# EAGLE schematic estop v2 (EAGLE 9.2.1)
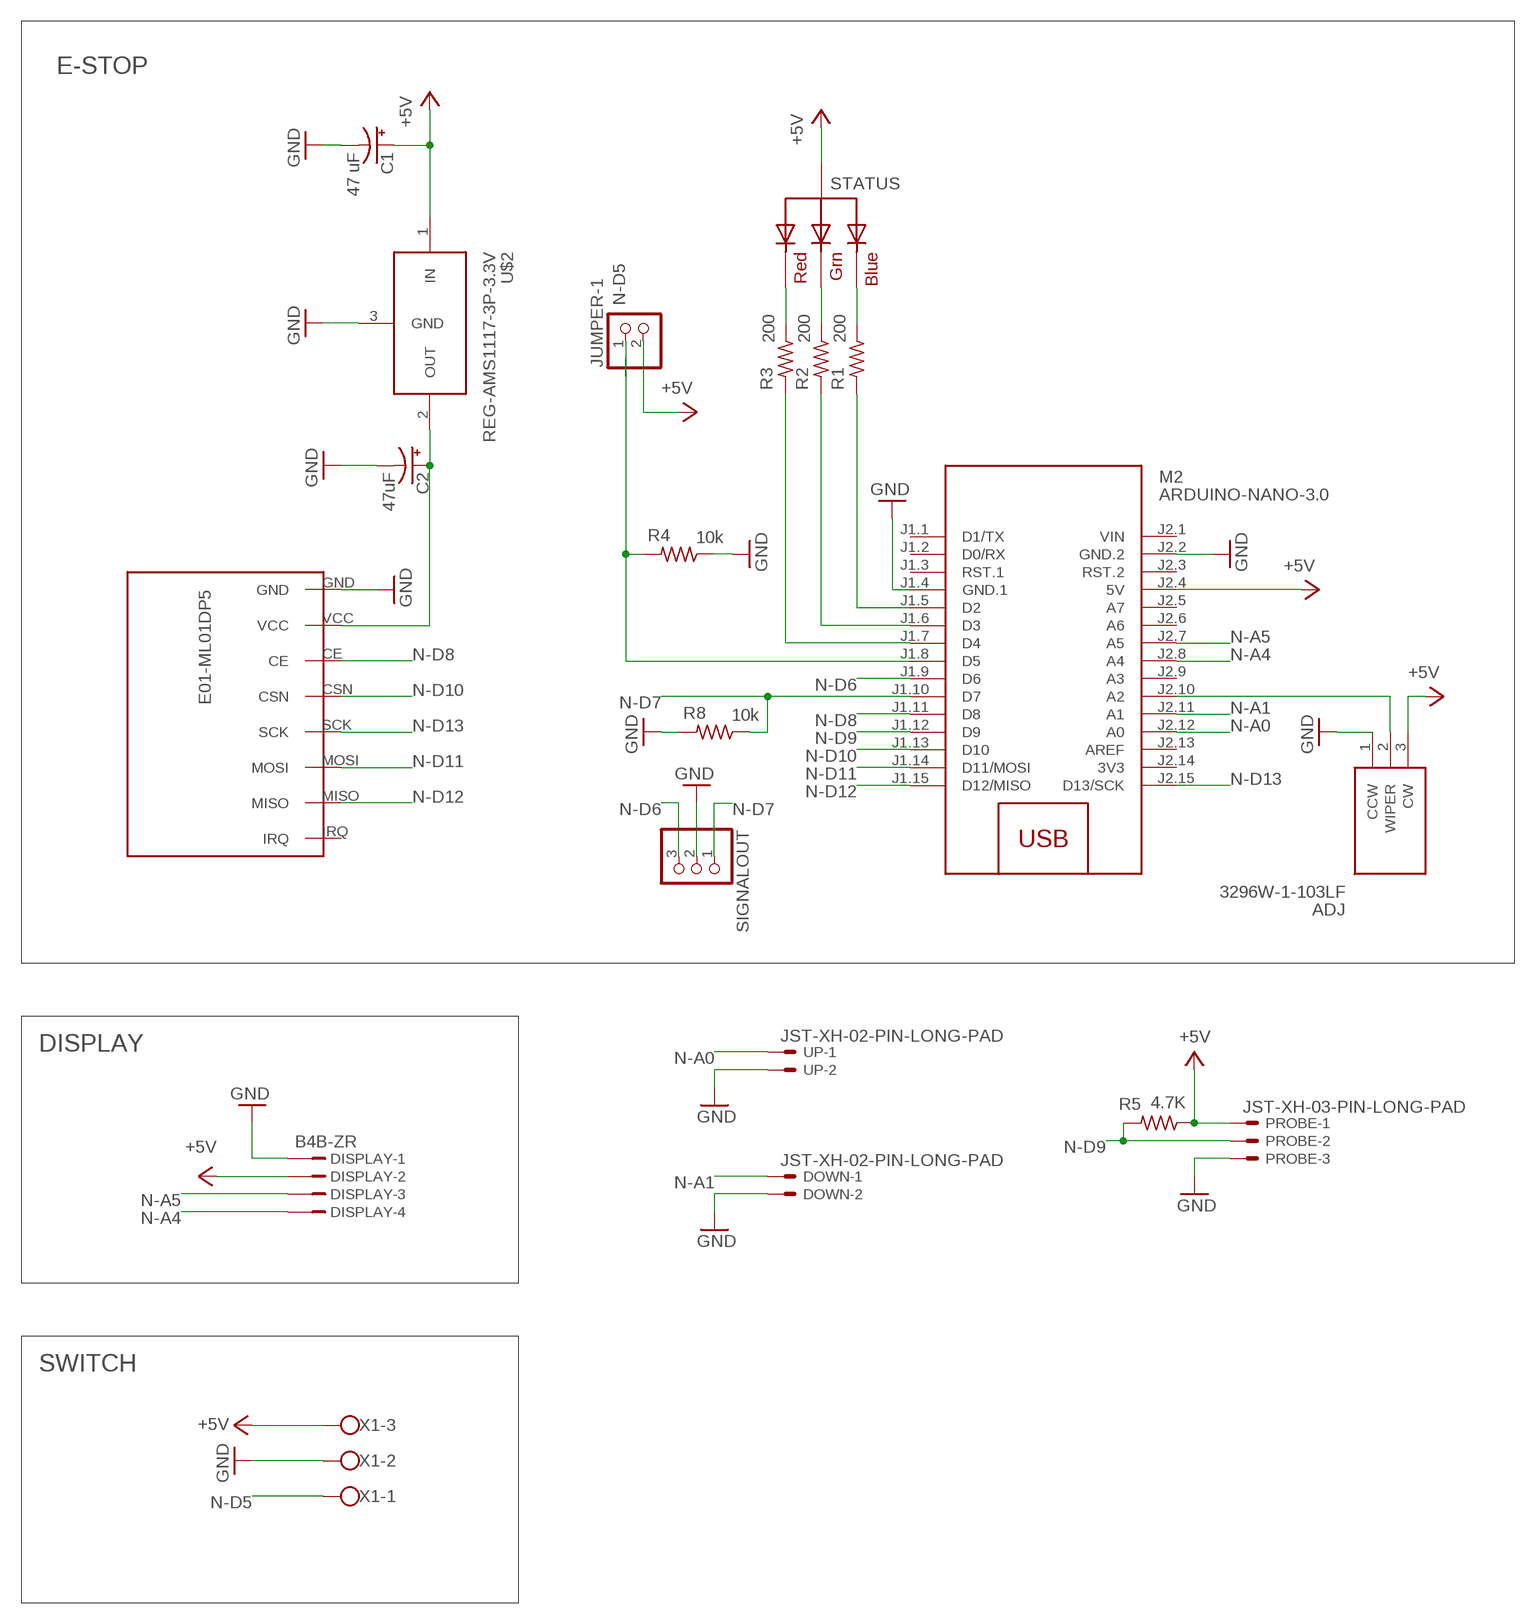
[diagram p0: schematic, sheet 1]

## Parts
ADJ  3296W-1-103LF  [SHDR3W54P0X254_1X3_953X483X115]
C1  47 uF  CPOL-USE2.5-5  [E2,5-5]
C2  47uF  CPOL-USE2.5-5  [E2,5-5]
DISPLAY  B4B-ZR  [B4B-ZR]
DOWN  JST-XH-02-PIN-LONG-PAD  [JST-XH-02-PACKAGE-LONG-PAD]
JUMPER-1  PINHD-1X2  [1X02]
M2  ARDUINO-NANO-3.0  [ARDUINO-NANO-3.0]
PROBE  JST-XH-03-PIN-LONG-PAD  [JST-XH-03-PACKAGE-LONG-PAD]
R1  200  R-US_M0805  [M0805]
R2  200  R-US_M0805  [M0805]
R3  200  R-US_M0805  [M0805]
R4  10k  R-US_M0805  [M0805]
R5  4.7K  R-US_M0805  [M0805]
R8  10k  R-US_M0805  [M0805]
SIGNALOUT  PINHD-1X3  [1X03]
STATUS  RGBLED_CA-5MM  [LED5MMRGB]
U$1  E01-ML01DP5  [E01-ML01DP5]
U$2  REG-AMS1117-3P-3.3V  [REG-AMS1117-3P]
UP  JST-XH-02-PIN-LONG-PAD  [JST-XH-02-PACKAGE-LONG-PAD]
X1  W237-103  [W237-103]

## Nets
+5V [Power]: ADJ.3(CW) C1.+ DISPLAY.2 JUMPER-1.2 M2.J2.4(5V) PROBE.1 R5.1 STATUS.2(VCC) U$2.1(IN) X1.3
GND: ADJ.1(CCW) C1.- C2.- DISPLAY.1 DOWN.2 M2.J1.4(GND.1) M2.J2.2(GND.2) PROBE.3 R4.1 R8.2 SIGNALOUT.2 U$1.GND U$2.3(GND) UP.2 X1.2
N$6: M2.J1.6(D3) R2.2
N$7: C2.+ U$1.VCC U$2.2(OUT)
N$8: R1.1 STATUS.4(BLUE)
N$9: R2.1 STATUS.3(GREEN)
N$10: R3.1 STATUS.1(RED)
N$11: M2.J1.5(D2) R1.2
N$12: M2.J1.7(D4) R3.2
N$13: ADJ.2(WIPER) M2.J2.10(A2)
N-A0: M2.J2.12(A0) UP.1
N-A1: DOWN.1 M2.J2.11(A1)
N-A4: DISPLAY.4 M2.J2.8(A4)
N-A5: DISPLAY.3 M2.J2.7(A5)
N-D5: JUMPER-1.1 M2.J1.8(D5) R4.2 X1.1
N-D6: M2.J1.9(D6) SIGNALOUT.3
N-D7: M2.J1.10(D7) R8.1 SIGNALOUT.1
N-D8: M2.J1.11(D8) U$1.CE
N-D9: M2.J1.12(D9) PROBE.2 R5.2
N-D10: M2.J1.13(D10) U$1.CSN
N-D11: M2.J1.14(D11/MOSI) U$1.MOSI
N-D12: M2.J1.15(D12/MISO) U$1.MISO
N-D13: M2.J2.15(D13/SCK) U$1.SCK
Unconnected: M2.J1.1(D1/TX) M2.J1.2(D0/RX) M2.J1.3(RST.1) M2.J2.3(RST.2) M2.J2.5(A7) M2.J2.6(A6) M2.J2.9(A3) M2.J2.13(AREF) U$1.IRQ

## Notes on the sheet
- E-STOP
- DISPLAY
- SWITCH

## Power pins joined to a net without a drawn wire
3V3: M2.J2.14(3V3)
VIN: M2.J2.1(VIN)

## Library data of the parts
ADJ = 3296W-1-103LF:3296W-1-103LF: Bourns 3296W Series 25-Turn Through Hole Cermet Trimmer Resistor with Pin Terminations, 10000???? ????10% 1/2W ????100ppm/????C Source: Datasheet <https://componentsearchengine.com/Datasheets/1/3296W-1-103LF.pdf>; DESCRIPTION: Bourns 3296W Series 25-Turn Through Hole Cermet Trimmer Resistor with Pin Terminations, 10000???? ????10% 1/2W ????100ppm/????C; HEIGHT: 11.55mm; MANUFACTURER_NAME: Bourns; MANUFACTURER_PART_NUMBER: 3296W-1-103LF; MOUSER_PART_NUMBER: 652-3296W-1-103LF; MOUSER_PRICE-STOCK: https://www.mouser.com/Search/Refine.aspx?Keyword=652-3296W-1-103LF
C1 C2 = rcl:CPOL-US: POLARIZED CAPACITOR, American symbol; SPICEPREFIX: C
DISPLAY = con-jst:?4B-ZR: ZH CONNECTOR 1.5 mm, 4 pin 1 row Source: http://www.jst.com .. eZH.pdf; MF: FARNELL; MPN: B4B-ZR(LF)(SN); OC_FARNELL: 1830916; OC_NEWARK: 37K9960
DOWN UP = Rembrandt Electronics - JST XH Connectors v1-0:JST-XH-02-PIN: JST XH Connector 2 Pin Wire to board connector. Pitch: 2,54 mm, (0.100") Number of pins: 2 Created by Rembrandt Electronics www.rembrandtelectronics.com
JUMPER-1 = pinhead:PINHD-1X2: PIN HEADER
M2 = diy-modules:ARDUINO-NANO-3.0: Arduino Nano 3.0 and compatible devices More details available here: https://www.arduino.cc/en/Main/ArduinoBoardNano Click here to find device on ebay.com <http://www.ebay.com/sch/arduino+nano>
PROBE = Rembrandt Electronics - JST XH Connectors v1-0:JST-XH-03-PIN: JST XH Connector 2 Pin Wire to board connector. Pitch: 2,54 mm, (0.100") Number of pins: 3 Created by Rembrandt Electronics www.rembrandtelectronics.com
R1-R5 R8 = adafruit:R-US_: RESISTOR, American symbol
SIGNALOUT = adafruit:PINHD-1X3: PIN HEADER
STATUS = adafruit:RGBLED_CA: RGB LED, common-anode 5MM Staggered pins 5mm Piranha package http://www.ladyada.net/library/pcb/eaglelibrary.html
U$1 = MyLibrary:E01-ML01DP5
U$2 = diy-modules:REG-AMS1117-3P-*: Linear Regulator based on AMS1117 chip 3-pin version AMS1117 datasheet is available here: http://www.advanced-monolithic.com/pdf/ds1117.pdf Click here to find device on ebay.com <http://www.ebay.com/sch/ams1117+module> Note: There are many variants. Search for the proper version.
X1 = con-wago-500:W237-103: WAGO SCREW CLAMP; MPN: 237-103; OC_FARNELL: unknown; OC_NEWARK: 18M7116

## Net classes
0 default: width 0.305 mm, drill 0.508 mm, clearance 0.254 mm
1 Power: width 1.27 mm, drill 0.508 mm, clearance 0.381 mm